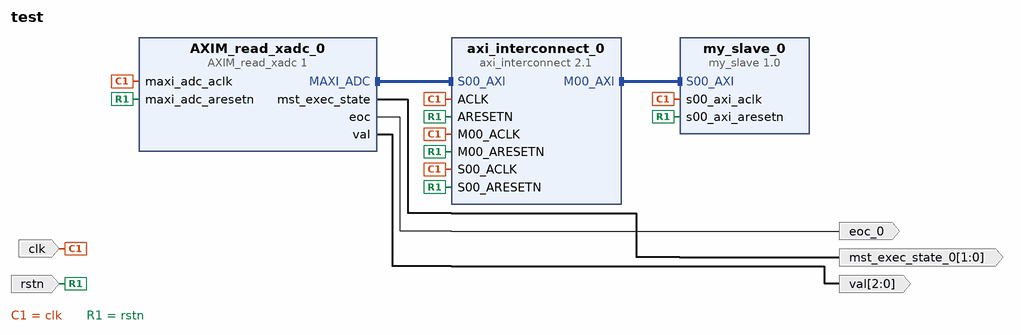
[diagram p0: block diagram of the top level]
# Vivado block design test, xc7z010clg400-1, Vivado 2019.2
create_bd_design test

create_bd_port -dir I -type clk clk
set_property -dict {CONFIG.FREQ_HZ 50000000} [get_bd_ports clk]
create_bd_port -dir I -type rst rstn
create_bd_port -dir O -from 1 -to 0 mst_exec_state_0
create_bd_port -dir O eoc_0
create_bd_port -dir O -from 2 -to 0 val

create_bd_cell -type ip -vlnv xilinx.com:ip:axi_interconnect:2.1 axi_interconnect_0
set_property -dict {CONFIG.NUM_MI 1} [get_bd_cells axi_interconnect_0]
create_bd_cell -type ip -vlnv user.org:user:my_slave:1.0 my_slave_0
create_bd_cell -type ip -vlnv user.org:user:AXIM_read_xadc:1 AXIM_read_xadc_0
set_property -dict {CONFIG.C_MAXI_ADC_TARGET_SLAVE_BASE_ADDR 0x44A00000} [get_bd_cells AXIM_read_xadc_0]

# ---- connections ----

connect_bd_intf_net [get_bd_intf_pins AXIM_read_xadc_0/MAXI_ADC] [get_bd_intf_pins axi_interconnect_0/S00_AXI]
connect_bd_intf_net [get_bd_intf_pins my_slave_0/S00_AXI] [get_bd_intf_pins axi_interconnect_0/M00_AXI]
connect_bd_net -net maxi_adc_aclk_0_1 [get_bd_ports clk] \
  [get_bd_pins axi_interconnect_0/ACLK] [get_bd_pins axi_interconnect_0/S00_ACLK] [get_bd_pins axi_interconnect_0/M00_ACLK] \
  [get_bd_pins my_slave_0/s00_axi_aclk] [get_bd_pins AXIM_read_xadc_0/maxi_adc_aclk]
connect_bd_net -net maxi_adc_aresetn_0_1 [get_bd_ports rstn] \
  [get_bd_pins axi_interconnect_0/ARESETN] [get_bd_pins axi_interconnect_0/S00_ARESETN] \
  [get_bd_pins axi_interconnect_0/M00_ARESETN] [get_bd_pins my_slave_0/s00_axi_aresetn] \
  [get_bd_pins AXIM_read_xadc_0/maxi_adc_aresetn]
connect_bd_net [get_bd_pins AXIM_read_xadc_0/mst_exec_state] [get_bd_ports mst_exec_state_0]
connect_bd_net [get_bd_pins AXIM_read_xadc_0/eoc] [get_bd_ports eoc_0]
connect_bd_net [get_bd_pins AXIM_read_xadc_0/val] [get_bd_ports val]

# ---- address map ----
assign_bd_address -offset 0x44A00000 -range 64K -target_address_space [get_bd_addr_spaces AXIM_read_xadc_0/MAXI_ADC] [get_bd_addr_segs my_slave_0/S00_AXI/S00_AXI_reg]

validate_bd_design
save_bd_design
